# EAGLE schematic Z80TestCircuit (EAGLE 6.1)
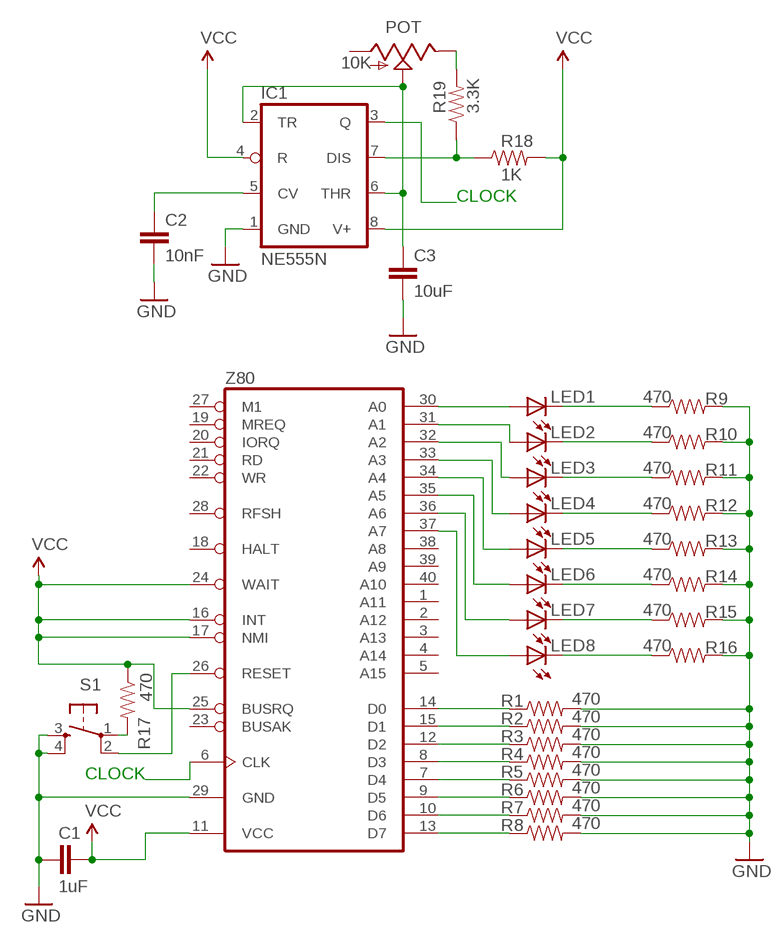
[diagram p0: schematic, sheet 1]

## Parts
C1  1uF  CAP  [E5-5]
C2  10nF  CAP  [E5-5]
C3  10uF  CAP  [E5-5]
IC1  NE555N  [DIL08-ROUND]
LED1  LED5MM  [LED5MM]
LED2  LED5MM  [LED5MM]
LED3  LED5MM  [LED5MM]
LED4  LED5MM  [LED5MM]
LED5  LED5MM  [LED5MM]
LED6  LED5MM  [LED5MM]
LED7  LED5MM  [LED5MM]
LED8  LED5MM  [LED5MM]
POT  10K  POT-RV16AF-20  [POT_ALPHA_RV16AF-20]
R1  470  RESISTORPTH-1/4W  [AXIAL-0.4]
R2  470  RESISTORPTH-1/4W  [AXIAL-0.4]
R3  470  RESISTORPTH-1/4W  [AXIAL-0.4]
R4  470  RESISTORPTH-1/4W  [AXIAL-0.4]
R5  470  RESISTORPTH-1/4W  [AXIAL-0.4]
R6  470  RESISTORPTH-1/4W  [AXIAL-0.4]
R7  470  RESISTORPTH-1/4W  [AXIAL-0.4]
R8  470  RESISTORPTH-1/4W  [AXIAL-0.4]
R9  470  RESISTORPTH-1/4W  [AXIAL-0.4]
R10  470  RESISTORPTH-1/4W  [AXIAL-0.4]
R11  470  RESISTORPTH-1/4W  [AXIAL-0.4]
R12  470  RESISTORPTH-1/4W  [AXIAL-0.4]
R13  470  RESISTORPTH-1/4W  [AXIAL-0.4]
R14  470  RESISTORPTH-1/4W  [AXIAL-0.4]
R15  470  RESISTORPTH-1/4W  [AXIAL-0.4]
R16  470  RESISTORPTH-1/4W  [AXIAL-0.4]
R17  470  RESISTORPTH-1/4W  [AXIAL-0.4]
R18  1K  RESISTORPTH-1/4W  [AXIAL-0.4]
R19  3.3K  RESISTORPTH-1/4W  [AXIAL-0.4]
S1  TAC_SWITCHPTH  [TACTILE-PTH]
Z80  Z80CPU  [DIL40]

## Nets
GND: C1.- C2.- C3.- IC1.1(GND) R1.P$2 R2.P$2 R3.P$2 R4.P$2 R5.P$2 R6.P$2 R7.P$2 R8.P$2 R9.P$2 R10.P$2 R11.P$2 R12.P$2 R13.P$2 R14.P$2 R15.P$2 R16.P$2 S1.3 S1.4 Z80.29(GND)
N$1: R1.P$1 Z80.14(D0)
N$2: R2.P$1 Z80.15(D1)
N$3: R3.P$1 Z80.12(D2)
N$4: R4.P$1 Z80.8(D3)
N$5: R5.P$1 Z80.7(D4)
N$6: R6.P$1 Z80.9(D5)
N$7: R7.P$1 Z80.10(D6)
N$8: R8.P$1 Z80.13(D7)
N$9: LED1.K(C) R9.P$1
N$10: LED2.K(C) R10.P$1
N$11: LED3.K(C) R11.P$1
N$12: LED4.K(C) R12.P$1
N$13: LED5.K(C) R13.P$1
N$14: LED6.K(C) R14.P$1
N$15: LED7.K(C) R15.P$1
N$16: LED8.K(C) R16.P$1
N$17: LED1.A Z80.30(A0)
N$18: LED2.A Z80.31(A1)
N$19: LED3.A Z80.32(A2)
N$20: LED4.A Z80.33(A3)
N$21: LED5.A Z80.34(A4)
N$22: LED6.A Z80.35(A5)
N$23: LED7.A Z80.36(A6)
N$24: LED8.A Z80.37(A7)
N$25: S1.2 Z80.26(RESET)
N$26: R17.P$2 S1.1
N$27: Z80.6(CLK)
N$28: IC1.7(DIS) R18.P$1 R19.P$1
N$29: C3.+ IC1.2(TR) IC1.6(THR) POT.2(S)
N$30: C2.+ IC1.5(CV)
N$31: IC1.3(Q)
N$32: POT.3(E) R19.P$2
VCC: C1.+ IC1.4(R) IC1.8(V+) R17.P$1 R18.P$2 Z80.11(VCC) Z80.16(INT) Z80.17(NMI) Z80.24(WAIT) Z80.25(BUSRQ)
Unconnected: POT.1(A) Z80.1(A11) Z80.2(A12) Z80.3(A13) Z80.4(A14) Z80.5(A15) Z80.18(HALT) Z80.19(MREQ) Z80.20(IORQ) Z80.21(RD) Z80.22(WR) Z80.23(BUSAK) Z80.27(M1) Z80.28(RFSH) Z80.38(A8) Z80.39(A9) Z80.40(A10)

## Notes on the sheet
- CLOCK
- CLOCK

## Library data of the parts
C1-C3 = MCParts:CAP: Capacitor Standard 0603 ceramic capacitor, and 0.1" leaded capacitor.
IC1 = adafruit:*555: TIMER Changed DIP package to have round (not oval) pin pads http://www.ladyada.net/library/pcb/eaglelibrary.html
LED1-LED8 = adafruit:LED: LED OSRAM: - CHIPLED LG R971, LG N971, LY N971, LG Q971, LY Q971, LO R971, LY R971 LH N974, LH R974 LS Q976, LO Q976, LY Q976 LO Q996 - Hyper CHIPLED LW Q18S LB Q993, LB Q99A, LB R99A - SideLED LS A670, LO A670, LY A670, LG A670, LP A670 LB A673, LV A673, LT A673, LW A673 LH A674 LY A675 LS A676, LA A676, LO A676, LY A676, LW A676 LS A679, LY A679, LG A679 - Hyper Micro SIDELED® LS Y876, LA Y876, LO Y876, LY Y876 LT Y87S - SmartLED LW L88C, LW L88S LB L89C, LB L89S, LG L890 LS L89K, LO L89K, LY L89K LS L896, LA L896, LO L896, LY L896 - TOPLED LS T670, LO T670, LY T670, LG T670, LP T670 LSG T670, LSP T670, LSY T670, LOP T670, LYG T670 LG T671, LOG T671, LSG T671 LB T673, LV T673, LT T673, LW T673 LH T674 LS T676, LA T676, LO T676, LY T676, LB T676, LH T676, LSB T676, LW T676 LB T67C, LV T67C, LT T67C, LS T67K, LO T67K, LY T67K, LW E67C LS E67B, LA E67B, LO E67B, LY E67B, LB E67C, LV E67C, LT E67C LW T67C LS T679, LY T679, LG T679 LS T770, LO T770, LY T770, LG T770, LP T770 LB T773, LV T773, LT T773, LW T773 LH T774 LS E675, LA E675, LY E675, LS T675 LS T776, LA T776, LO T776, LY T776, LB T776 LHGB T686 LT T68C, LB T68C - Hyper Mini TOPLED® LB M676 - Mini TOPLED Santana® LG M470 LS M47K, LO M47K, LY M47K Source: http://www.osram.convergy.de/
POT = SparkFun:POT
R1-R19 = MCParts:RESISTOR: Resistor Basic schematic elements and footprints for 0603, 1206, and PTH resistors.
S1 = MCParts:TAC_SWITCH: Momentary Switch Button commonly used for reset or general input. Spark Fun Electronics SKU : COM-00097
Z80 = zilog:Z80CPU: Z80 FAMILY DEVICE